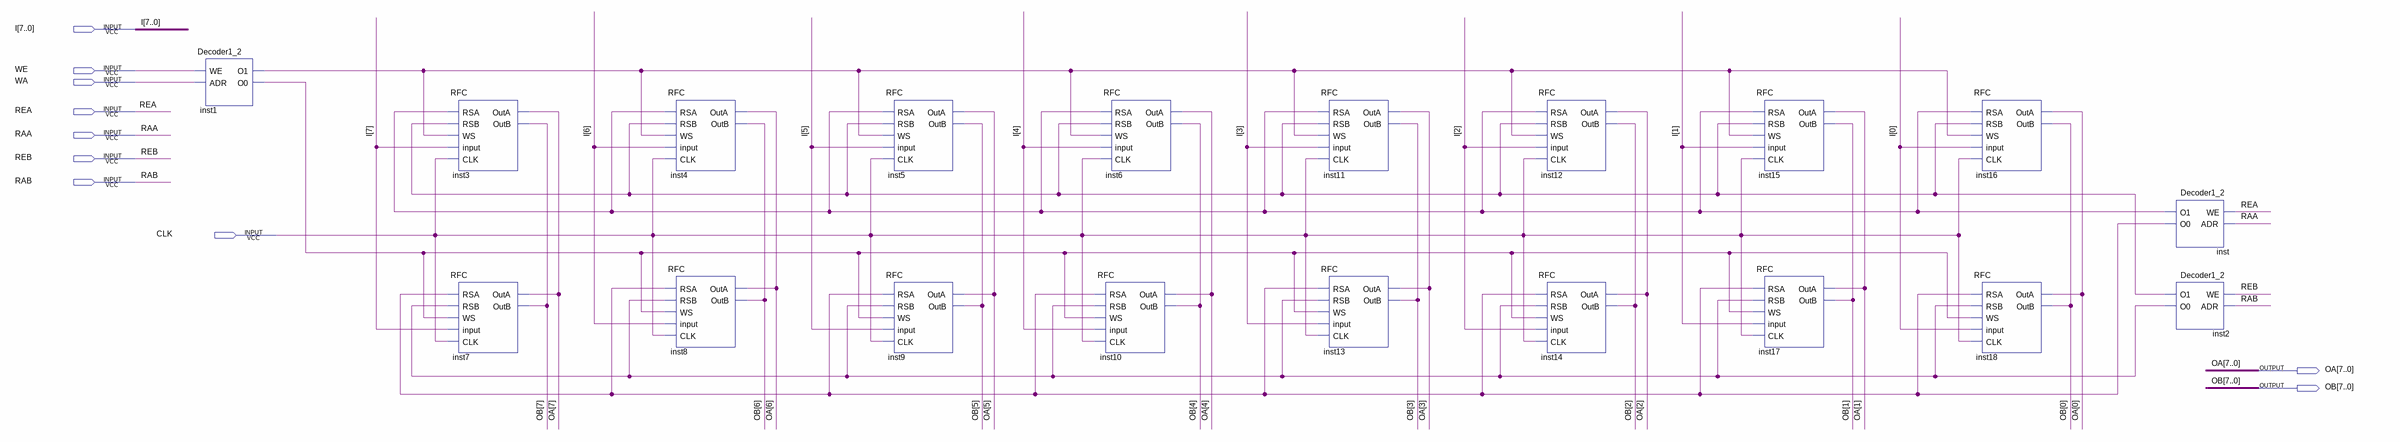
[diagram p0: schematic sheet]
// Quartus schematic Register2x8.bdf as structural Verilog: 19 symbols, 10 pins
module Register2x8 (
  input  [7:0] I,
  input  WE,
  input  WA,
  input  REA,
  input  RAA,
  input  REB,
  input  RAB,
  input  CLK,
  output [7:0] OA,
  output [7:0] OB
);

  wire inst1_o0, inst1_o1, inst2_o0, inst2_o1, inst_o0, inst_o1;

  Decoder1_2 inst1 (.WE(WE), .ADR(WA), .O1(inst1_o1), .O0(inst1_o0));
  RFC inst3 (.RSA(inst_o1), .RSB(inst2_o1), .WS(inst1_o1), .\input (I[7]), .CLK(CLK), .OutA(OA[7]), .OutB(OB[7]));
  RFC inst7 (.RSA(inst_o0), .RSB(inst2_o0), .WS(inst1_o0), .\input (I[7]), .CLK(CLK), .OutA(OA[7]), .OutB(OB[7]));
  RFC inst4 (.RSA(inst_o1), .RSB(inst2_o1), .WS(inst1_o1), .\input (I[6]), .CLK(CLK), .OutA(OA[6]), .OutB(OB[6]));
  RFC inst8 (.RSA(inst_o0), .RSB(inst2_o0), .WS(inst1_o0), .\input (I[6]), .CLK(CLK), .OutA(OA[6]), .OutB(OB[6]));
  RFC inst5 (.RSA(inst_o1), .RSB(inst2_o1), .WS(inst1_o1), .\input (I[5]), .CLK(CLK), .OutA(OA[5]), .OutB(OB[5]));
  RFC inst9 (.RSA(inst_o0), .RSB(inst2_o0), .WS(inst1_o0), .\input (I[5]), .CLK(CLK), .OutA(OA[5]), .OutB(OB[5]));
  RFC inst6 (.RSA(inst_o1), .RSB(inst2_o1), .WS(inst1_o1), .\input (I[4]), .CLK(CLK), .OutA(OA[4]), .OutB(OB[4]));
  RFC inst10 (.RSA(inst_o0), .RSB(inst2_o0), .WS(inst1_o0), .\input (I[4]), .CLK(CLK), .OutA(OA[4]), .OutB(OB[4]));
  RFC inst11 (.RSA(inst_o1), .RSB(inst2_o1), .WS(inst1_o1), .\input (I[3]), .CLK(CLK), .OutA(OA[3]), .OutB(OB[3]));
  RFC inst13 (.RSA(inst_o0), .RSB(inst2_o0), .WS(inst1_o0), .\input (I[3]), .CLK(CLK), .OutA(OA[3]), .OutB(OB[3]));
  RFC inst12 (.RSA(inst_o1), .RSB(inst2_o1), .WS(inst1_o1), .\input (I[2]), .CLK(CLK), .OutA(OA[2]), .OutB(OB[2]));
  RFC inst14 (.RSA(inst_o0), .RSB(inst2_o0), .WS(inst1_o0), .\input (I[2]), .CLK(CLK), .OutA(OA[2]), .OutB(OB[2]));
  RFC inst15 (.RSA(inst_o1), .RSB(inst2_o1), .WS(inst1_o1), .\input (I[1]), .CLK(CLK), .OutA(OA[1]), .OutB(OB[1]));
  RFC inst17 (.RSA(inst_o0), .RSB(inst2_o0), .WS(inst1_o0), .\input (I[1]), .CLK(CLK), .OutA(OA[1]), .OutB(OB[1]));
  RFC inst16 (.RSA(inst_o1), .RSB(inst2_o1), .WS(inst1_o1), .\input (I[0]), .CLK(CLK), .OutA(OA[0]), .OutB(OB[0]));
  RFC inst18 (.RSA(inst_o0), .RSB(inst2_o0), .WS(inst1_o0), .\input (I[0]), .CLK(CLK), .OutA(OA[0]), .OutB(OB[0]));
  Decoder1_2 inst (.WE(REA), .ADR(RAA), .O1(inst_o1), .O0(inst_o0));
  Decoder1_2 inst2 (.WE(REB), .ADR(RAB), .O1(inst2_o1), .O0(inst2_o0));
endmodule
